# Altium project Left Board.PrjPCB
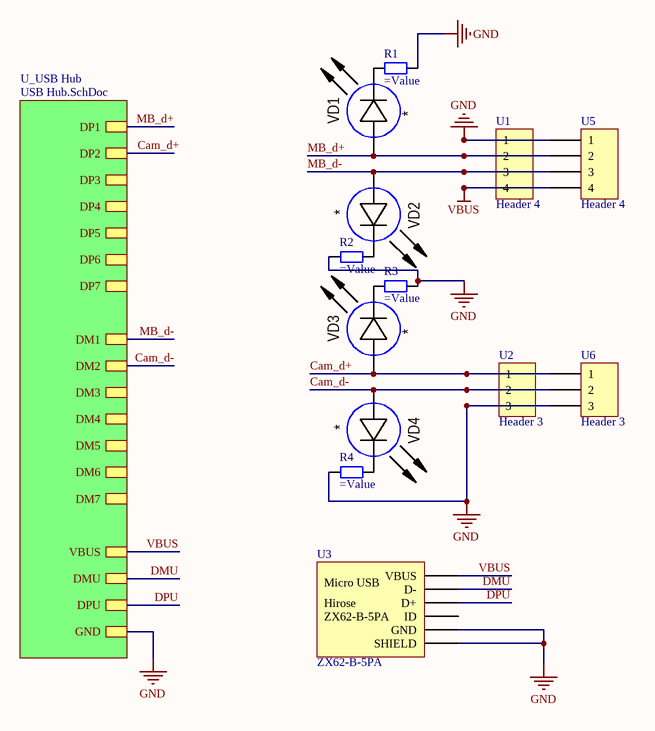
[diagram p0: Main Sheet.SchDoc]
2 sheets, 22 parts. Net scope: hierarchical (ports join the sheet entries above them; power ports are global).
Board file: Left Board.PcbDoc
Sheets:
  Main Sheet.SchDoc
    U_USB Hub = USB Hub.SchDoc

## Sheet Main Sheet.SchDoc
size A4

### Parts
R1  (no value)  [res0402]
R2  (no value)  [res0402]
R3  (no value)  [res0402]
R4  (no value)  [res0402]
U1  Header 4  [4x1.25]
U2  Header 3  [3x1.25]
U3  ZX62-B-5PA  [ZX62-B-5PA]
U5  Header 4  [CON: PLS-4]
U6  Header 3  [3x2.54]
VD1  *  [CH0603LB]
VD2  *  [CH0603LB]
VD3  *  [CH0603LB]
VD4  *  [CH0603LB]

### Sub-sheets
U_USB Hub = USB Hub.SchDoc: VBUS, DMU, DPU, GND, DM1, DM2, DM3, DM4, DM5, DM6, DM7, DP1, DP2, DP3, DP4, DP5, DP6, DP7

### Nets
GND: R1.2 R2.1 R3.2 R4.1 U1.1 U2.3 U3.5(GND) U3.6(SHIELD) U5.1 U6.3 ; sheet U_USB Hub/GND
VBUS: U1.4 U3.1(VBUS) U5.4 ; sheet U_USB Hub/VBUS
Cam_d+: U2.1 U6.1 VD3.1(A) ; sheet U_USB Hub/DP2
Cam_d-: U2.2 U6.2 VD4.1(A) ; sheet U_USB Hub/DM2
DMU: U3.2(D-) ; sheet U_USB Hub/DMU
DPU: U3.3(D+) ; sheet U_USB Hub/DPU
MB_d+: U1.2 U5.2 VD1.1(A) ; sheet U_USB Hub/DP1  [project net DP1]
MB_d-: U1.3 U5.3 VD2.1(A) ; sheet U_USB Hub/DM1  [project net DM1]
NetR1_1: R1.1 VD1.2(C)
NetR2_2: R2.2 VD2.2(C)
NetR3_1: R3.1 VD3.2(C)
NetR4_2: R4.2 VD4.2(C)

Not connected (* = marked no-connect by the designer): U3 4(ID)

### Notes on the sheet
- (in symbol ZX62-B-5PA) Micro USB; Hirose

### Library data of the parts
R1-R4 = Resistor SMD
VD1-VD4 = LED: Manufacturer: *; Model: *; HelpURL: *; ComponentKind: *; Value: *

## Sheet USB Hub.SchDoc
size A4
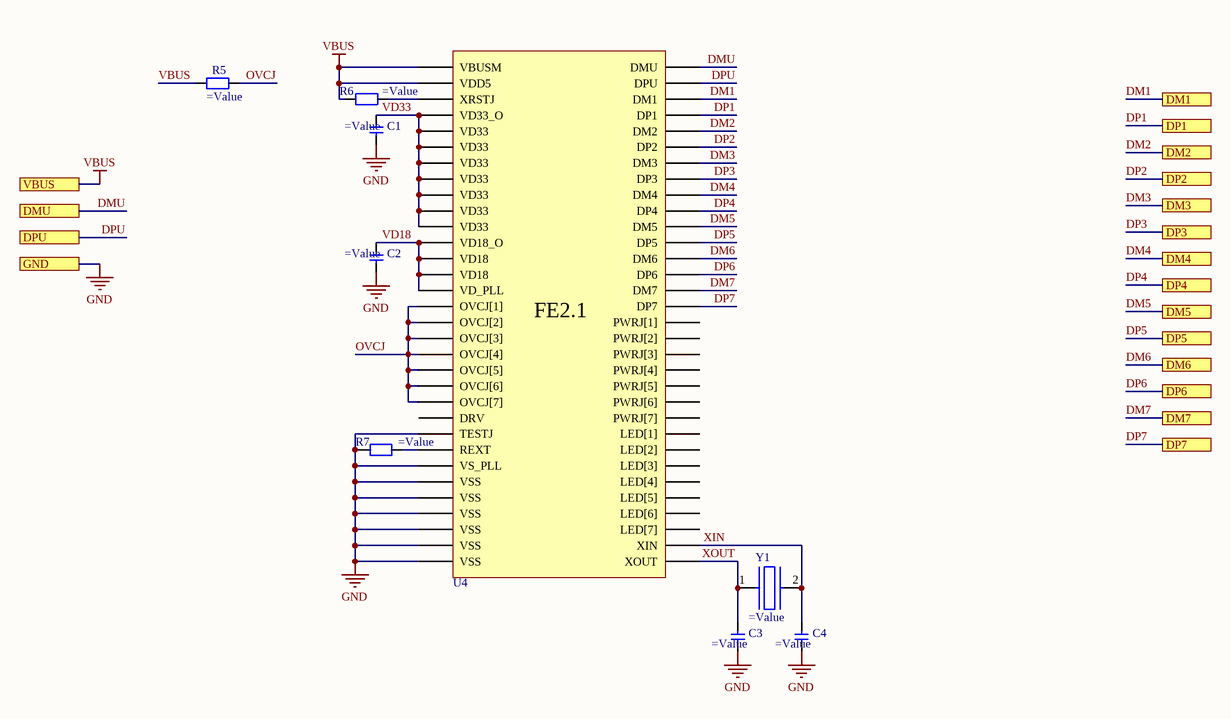
[diagram p1: USB Hub.SchDoc]

### Parts
C1  (no value)  [cap0402]
C2  (no value)  [cap0402]
C3  (no value)  [cap0402]
C4  (no value)  [cap0402]
R5  (no value)  [res0402]
R6  (no value)  [res0402]
R7  (no value)  [res0402]
U4  FE2.1  [LQFP64_N_1]  (value not drawn)
Y1  (no value)  [QSMD3.2x2.5_A]

### Ports
DM1, DM2, DM3, DM4, DM5, DM6, DM7, DMU, DP1, DP2, DP3, DP4, DP5, DP6, DP7, DPU, GND, VBUS

### Nets
GND: C1.1 C2.1 C3.1 C4.1 R7.1 U4.3(TESTJ) U4.11(VSS) U4.19(VSS) U4.25(VSS) U4.32(VS_PLL) U4.37(VSS) U4.43(VSS) U4.49(VSS) ; port GND
VBUS: R5.1 R6.1 U4.9(VDD5) U4.51(VBUSM) ; port VBUS
DM1: U4.26(DM1) ; port DM1
DM2: U4.23(DM2) ; port DM2  [project net Cam_d-]
DM3: U4.20(DM3) ; port DM3
DM4: U4.17(DM4) ; port DM4
DM5: U4.41(DM5) ; port DM5
DM6: U4.44(DM6) ; port DM6
DM7: U4.47(DM7) ; port DM7
DMU: U4.38(DMU) ; port DMU
DP1: U4.27(DP1) ; port DP1
DP2: U4.24(DP2) ; port DP2  [project net Cam_d+]
DP3: U4.21(DP3) ; port DP3
DP4: U4.18(DP4) ; port DP4
DP5: U4.42(DP5) ; port DP5
DP6: U4.45(DP6) ; port DP6
DP7: U4.48(DP7) ; port DP7
DPU: U4.39(DPU) ; port DPU
OVCJ: R5.2 U4.13(OVCJ[3]) U4.15(OVCJ[4]) U4.53(OVCJ[7]) U4.55(OVCJ[6]) U4.58(OVCJ[5]) U4.60(OVCJ[1]) U4.62(OVCJ[2])
VD18: C2.2 U4.7(VD18) U4.29(VD_PLL) U4.33(VD18_O) U4.36(VD18)
VD33: C1.2 U4.10(VD33_O) U4.16(VD33) U4.22(VD33) U4.28(VD33) U4.34(VD33) U4.40(VD33) U4.46(VD33) U4.56(VD33)
XIN: C4.2 U4.30(XIN) Y1.2
XOUT: C3.2 U4.31(XOUT) Y1.1
NetR6_2: R6.2 U4.50(XRSTJ)
NetR7_2: R7.2 U4.35(REXT)

Not connected (* = marked no-connect by the designer): U4 1(LED[5]) 2(DRV) 4(LED[1]) 5(LED[2]) 6(LED[3]) 8(LED[4]) 12(PWRJ[3]) 14(PWRJ[4]) 52(PWRJ[7]) 54(PWRJ[6]) 57(PWRJ[5]) 59(PWRJ[1]) 61(PWRJ[2]) 63(LED[7]) 64(LED[6])

### Library data of the parts
C1-C4 = Cap SMD
R5-R7 = Resistor SMD
Y1 = Quartz

## Nets that join several sheets
GND: Main Sheet (10 pins), USB Hub (13 pins)
VBUS: Main Sheet (U1.4 U3.1 U5.4), USB Hub (R5.1 R6.1 U4.9 U4.51)
Cam_d+: Main Sheet (U2.1 U6.1 VD3.1), USB Hub (U4.24)
Cam_d-: Main Sheet (U2.2 U6.2 VD4.1), USB Hub (U4.23)
DM1: Main Sheet (U1.3 U5.3 VD2.1), USB Hub (U4.26)
DMU: Main Sheet (U3.2), USB Hub (U4.38)
DP1: Main Sheet (U1.2 U5.2 VD1.1), USB Hub (U4.27)
DPU: Main Sheet (U3.3), USB Hub (U4.39)